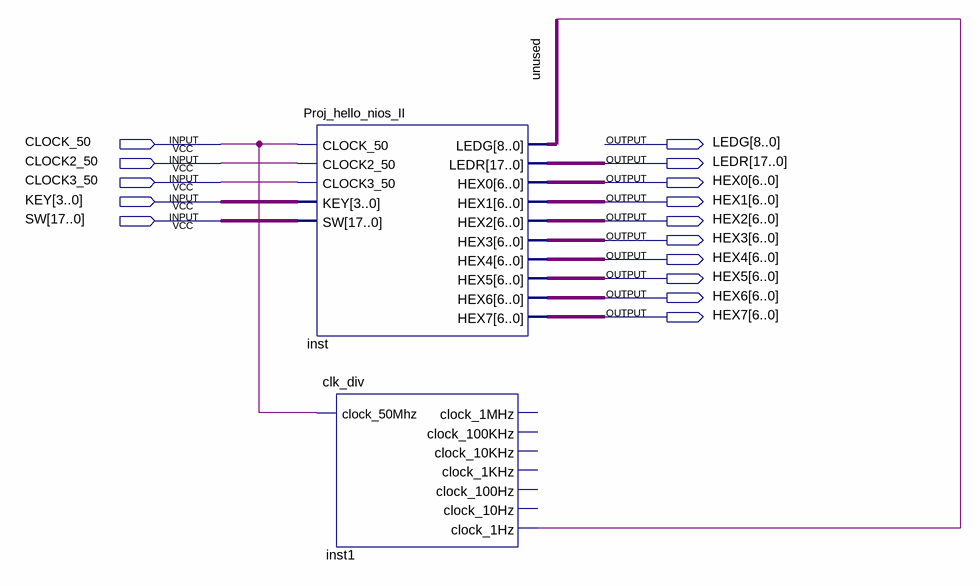
[diagram p0: schematic sheet]
// Quartus schematic ProJ_hello_nios_II.bdf as structural Verilog: 2 symbols, 15 pins
module ProJ_hello_nios_II (
  input  CLOCK_50,
  input  CLOCK2_50,
  input  CLOCK3_50,
  input  [3:0] KEY,
  input  [17:0] SW,
  output [8:0] LEDG,
  output [17:0] LEDR,
  output [6:0] HEX0,
  output [6:0] HEX1,
  output [6:0] HEX2,
  output [6:0] HEX3,
  output [6:0] HEX4,
  output [6:0] HEX5,
  output [6:0] HEX6,
  output [6:0] HEX7
);

  wire unused;

  Proj_hello_nios_II inst (
    .CLOCK_50(CLOCK_50), .CLOCK2_50(CLOCK2_50), .CLOCK3_50(CLOCK3_50), .KEY(KEY), .SW(SW), .LEDG(unused),
    .LEDR(LEDR), .HEX0(HEX0), .HEX1(HEX1), .HEX2(HEX2), .HEX3(HEX3), .HEX4(HEX4), .HEX5(HEX5), .HEX6(HEX6),
    .HEX7(HEX7));
  clk_div inst1 (
    .clock_50Mhz(CLOCK_50), .clock_1Hz(unused));  // open: clock_1MHz, clock_100KHz, clock_10KHz, clock_1KHz, clock_100Hz, clock_10Hz
endmodule
